# EasyEDA Pro project PID调试器（第一版）.eprj

# Schematic Schematic1
Board Name: Board1; Create Date: 2025-07-22; Page Name: P1; Project Name: PID调试器; Schematic Name: Schematic1; Update Date: 2025-08-16; Company: 嘉立创EDA; Page Size: A4; Version: V1.0
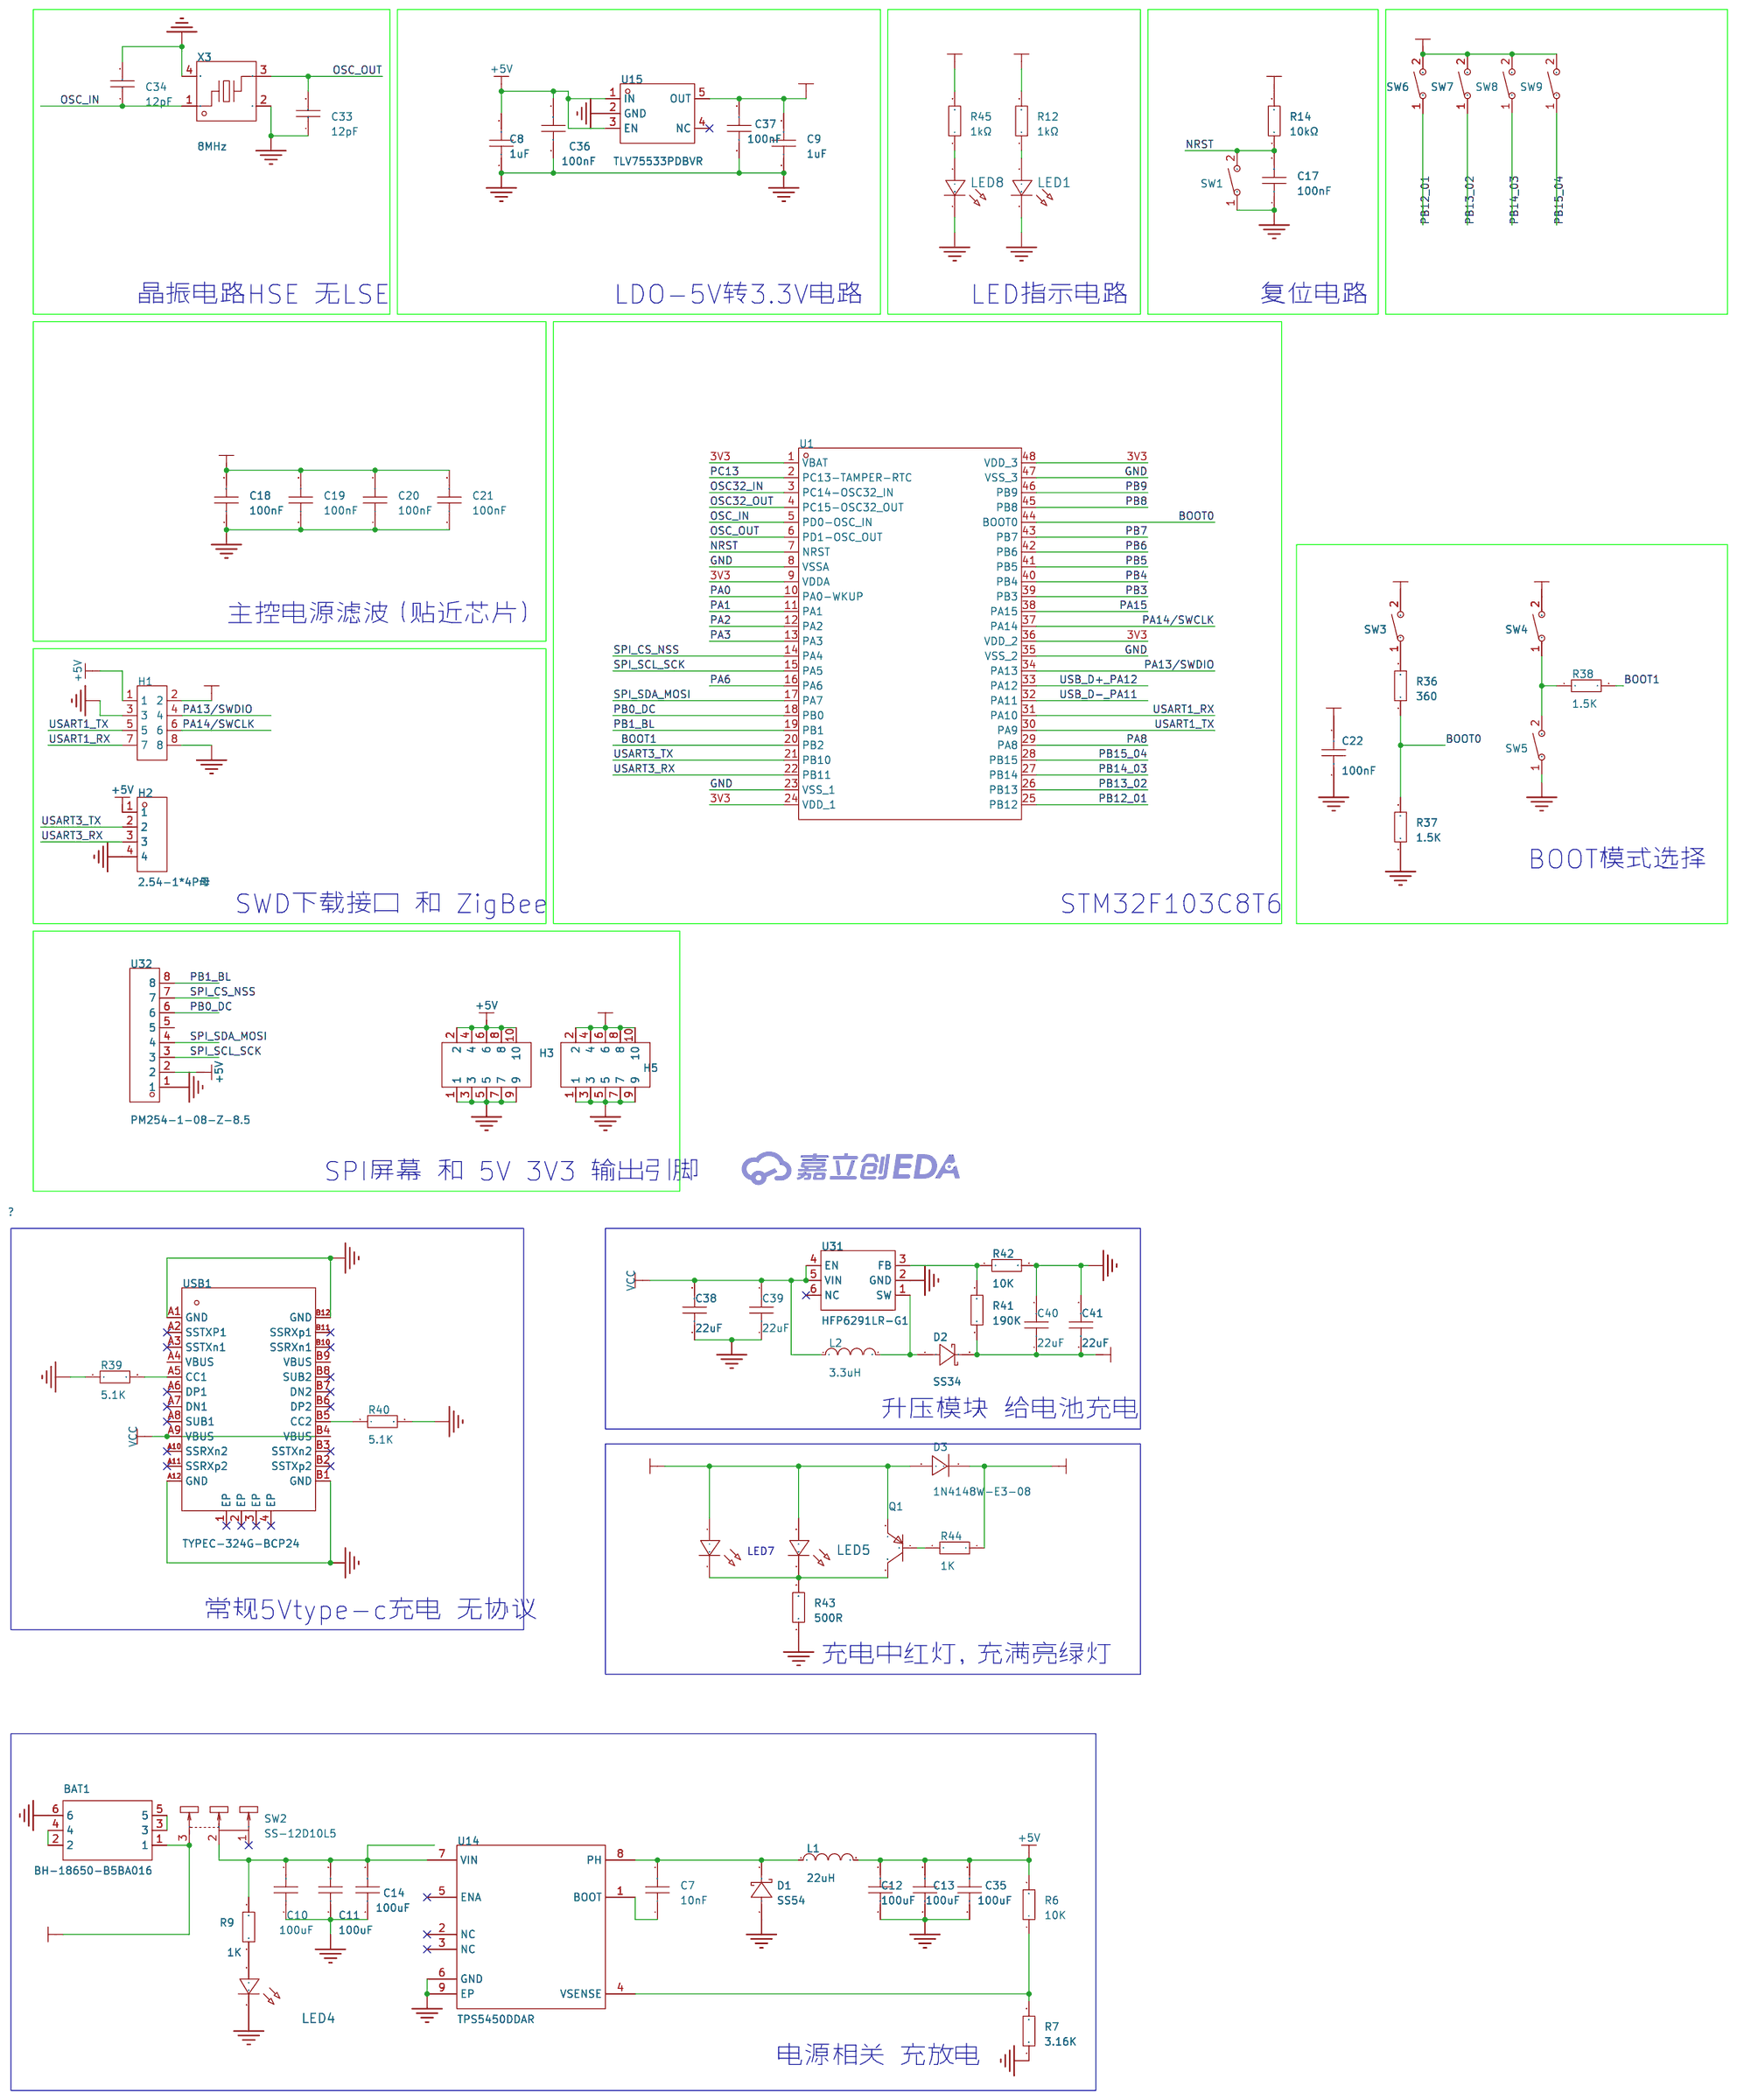
[diagram p0: schematic sheet]

## Parts
BAT1  BH-18650-B5BA016  [BAT-SMD_BH-18650-B5BA016]
C7  100nF  [C0603]
C8  100nF  [C0603]
C9  100nF  [C0603]
C10  100uF  [C1206]
C11  100uF  [C1206]
C12  100uF  [C1206]
C13  100uF  [C1206]
C14  100uF  [C1206]
C17  100nF  [R0603]
C18  100nF  [R0603]
C19  100nF  [R0603]
C20  100nF  [R0603]
C21  100nF  [R0603]
C22  100nF  [R0603]
C33  12pF  [R0603]
C34  12pF  [R0603]
C35  100uF  [C1206]
C36  100nF  [R0603]
C37  100nF  [R0603]
C38  22uF  [C0603]
C39  22uF  [C0603]
C40  22uF  [C0603]
C41  22uF  [C0603]
D1  SS54  [SMA_L4.3-W2.6-LS5.0-FD]
D2  SS34  [SMA_L4.3-W2.6-LS5.0-FD]
D3  1N4148W-E3-08  [SOD-123_L2.8-W1.8-LS3.7-RD]
H1  HX PZ2.54-4x2P ZZ  [HDR-TH_8P-P2.54-V-M-R2-C4-S2.54]
H2  2.54-1*4P母  [HDR-TH_4P-P2.54-V-F]
H3  PZ254V-12-10P  [HDR-TH_10P-P2.54-V-M-R2-C5-S2.54]
H5  PZ254V-12-10P  [HDR-TH_10P-P2.54-V-M-R2-C5-S2.54]
L1  22uH  [IND-SMD_L7.1-W6.6]
L2  3.3uH  [IND-SMD_L4.4-W4.2-A]
LED1  LTST-C190KSKT  [LED0603-RD]
LED4  -  [LED_0603]
LED5  -  [LED_0603]
LED7  -  [LED_0603]
LED8  LTST-C190KSKT  [LED0603-RD]
Q1  -  [S8550P_SOT]
R6  10K  [R0603]
R7  10K  [R0603]
R9  1K  [R0603]
R12  1kΩ  [R0603]
R14  10kΩ  [R0603]
R36  360  [R0603]
R37  1.5K  [R0603]
R38  1.5K  [R0603]
R39  5.1K  [R0603]
R40  5.1K  [R0603]
R41  190K  [R0603]
R42  10K  [R0603]
R43  500R  [R0603]
R44  1K  [R0603]
R45  1kΩ  [R0603]
SW1  TS-1101-B-W  [KEY-SMD_2P-L6.0-W3.6-P7.4-LS8.0-L]
SW2  SS-12D10L5  [SW-TH_SS-12D10L5]
SW3  TS-1101-B-W  [KEY-SMD_2P-L6.0-W3.6-P7.4-LS8.0-L]
SW4  TS-1101-B-W  [KEY-SMD_2P-L6.0-W3.6-P7.4-LS8.0-L]
SW5  TS-1101-B-W  [KEY-SMD_2P-L6.0-W3.6-P7.4-LS8.0-L]
SW6  TS-1101-B-W  [KEY-SMD_2P-L6.0-W3.6-P7.4-LS8.0-L]
SW7  TS-1101-B-W  [KEY-SMD_2P-L6.0-W3.6-P7.4-LS8.0-L]
SW8  TS-1101-B-W  [KEY-SMD_2P-L6.0-W3.6-P7.4-LS8.0-L]
SW9  TS-1101-B-W  [KEY-SMD_2P-L6.0-W3.6-P7.4-LS8.0-L]
U1  STM32F103C8T6  [LQFP-48_L7.0-W7.0-P0.50-LS9.0-BL]
U14  TPS5450DDAR  [SOP-8_L4.9-W3.9-P1.27-LS6.0-BL-EP]
U15  TLV75533PDBVR  [SOT-23-5_L3.0-W1.7-P0.95-LS2.8-BR]
U31  HFP6291LR-G1  [SOT-23-6_L2.9-W1.6-P0.95-LS2.8-BR]
U32  PM254-1-08-Z-8.5  [HDR-TH_8P-P2.54-V-F]
USB1  TYPEC-324G-BCP24  [USB-C-SMD_TYPEC-324G-BCP24]
X3  8MHz  [CRYSTAL-SMD_4P-L3.2-W2.5-BL-1]

## Library data of the parts
BAT1 = BH-18650-B5BA016: LCSC Part Name: 电池盒; Supplier Part: C19184086; Manufacturer: MYOUNG(美阳); Supplier Footprint: SMD; JLCPCB Part Class: 扩展库; Datasheet: https://atta.szlcsc.com/upload/public/pdf/source/20231108/D1617EC59CD55304B33DC60D90FEF183.pdf; Supplier: LCSC; Connector Type: 电池盒; Contact Plating: 金; Operating Temperature Range: -25℃~+85℃
C7-C9 C38-C41 = CAP_0603: Supplier Footprint: 0603
C10-C14 C35 = HGC1206R5107M100NSPJ: 容值:100uF;精度:±20%;额定电压:10V;材质(温度系数):X5R;; LCSC Part Name: 100uF ±20% 10V; Supplier Part: C7432784; Manufacturer: Chinocera(华瓷); Supplier Footprint: 1206; JLCPCB Part Class: 扩展库; Datasheet: https://atta.szlcsc.com/upload/public/pdf/source/20240320/FAC3FEC40A78BC5CCCE96C232A94D860.pdf; Supplier: LCSC; Tolerance: ±20%; Voltage Rated: 10V; Temperature Coefficient: X5R
C17-C22 C36 C37 = GRM155R71H104KE14D: 容值:100nF;精度:±10%;额定电压:50V;材质(温度系数):X7R;; LCSC Part Name: 100nF ±10% 50V; Supplier Part: C77020; Manufacturer: muRata(村田); Supplier Footprint: 0402; JLCPCB Part Class: 扩展库; Datasheet: https://atta.szlcsc.com/upload/public/pdf/source/20180326/C77020_39BD49C951FF1AF0DB1F1FAC5AC1E401.pdf; Supplier: LCSC; Tolerance: ±10%; Voltage Rated: 50V; Temperature Coefficient: X7R
C33 C34 = 0402CG120J500NT: 容值:12pF;精度:±5%;额定电压:50V;材质(温度系数):C0G;; LCSC Part Name: 12pF ±5% 50V; Supplier Part: C1547; Manufacturer: FH(风华); Supplier Footprint: 0402; JLCPCB Part Class: 基础库; Datasheet: https://atta.szlcsc.com/upload/public/pdf/source/20200305/C486355_26A10D38EF8C2A5C37091D0039909270.pdf; Supplier: LCSC; Tolerance: ±5%; Voltage Rated: 50V; Temperature Coefficient: C0G
D1 = SS54_C7420369: 二极管配置:独立式;正向压降(Vf):550mV@5.0A;直流反向耐压(Vr):40V;整流电流:5A;; LCSC Part Name: 电压:40V 电流:5A; Supplier Part: C7420369; Manufacturer: 宏迦橙; Supplier Footprint: SMA(DO-214AC); Datasheet: https://atta.szlcsc.com/upload/public/pdf/source/20230828/254C3882F8647358AD9F60DD73611B5E.pdf; Supplier: LCSC; Diode Configuration: 独立式; Forward Voltage (Vf@If): 550mV@5.0A; Reverse Voltage (Vr): 40V; Rectified Current: 5A; Reverse Leakage Current (Ir): 50uA@40V
D2 = SS34_C7420365: LCSC Part Name: 电压:40V 电流:3A; Supplier Part: C7420365; Manufacturer: 宏嘉诚; Supplier Footprint: SMA(DO-214AC); JLCPCB Part Class: 扩展库; Datasheet: https://item.szlcsc.com/datasheet/SS34/8397187.html; Supplier: LCSC; Diode Configuration: 独立式; Voltage - Forward(Vf@If): 550mV@3.0A; Voltage - DC Reverse(Vr): 40V; Current - Rectified: 3A; Reverse Leakage Current (Ir): 200uA@40V
D3 = 1N4148W-E3-08: Supplier Part: C241939; Manufacturer: VISHAY(威世); Supplier Footprint: SOD-123; Datasheet: https://item.szlcsc.com/datasheet/1N4148W-E3-08/240783.html; Supplier: LCSC; Diode Configuration: 1个独立式; Voltage - Forward(Vf@If): 1.2V@100mA; Voltage - DC Reverse(Vr): 75V; Current - Rectified: 150mA; Pd - Power Dissipation: 350mW; Reverse Leakage Current (Ir): 100uA@100V; Reverse Recovery Time (trr): 4ns; Non-Repetitive Peak Forward Surge Current: 2A
H1 = HX PZ2.54-4x2P ZZ: LCSC Part Name: 4x2P 间距:2.54mm 方针 直插; Supplier Part: C32713296; Manufacturer: hanxia(韩下); Supplier Footprint: 插件,P=2.54mm; JLCPCB Part Class: 扩展库; Datasheet: https://atta.szlcsc.com/upload/public/pdf/source/20240723/0F23DD8D77880DC95952980E48B1CF7C.pdf; Supplier: LCSC; Pin Structure: 4x2P; Pitch: 2.54mm; Row Spacing: 2.54mm; Circluar Pins/Square Pins: 方针; Mounting Type: 直插; Number of Rows: 四排; Number of Pins: 8P; Current Rating: 3A; Length of Mating Pin: 6mm; Insulation Height: 2.5mm; Length of End Connection Pin: 3mm; Contact Material: 黄铜; Contact Plating: 金; Operating Temperature: -40℃~+105℃; Color: 黑色
H2 = 2.54-1*4P母: LCSC Part Name: 间距:2.54mm 1x4P 直插; Supplier Part: C2718488; Manufacturer: BOOMELE(博穆精密); Supplier Footprint: 插件,P=2.54mm; JLCPCB Part Class: 扩展库; Datasheet: https://atta.szlcsc.com/upload/public/pdf/source/20210301/C2718488_F4427B881E42CAA8DDB0B1C12B3A522C.pdf; Supplier: LCSC; Holes Structure: 1x4P; Pitch: 2.54mm; Circular Hole / Square Hole: 方孔; Mounting Type: 直插; Number of Rows: 单排; Number of Holes: 4P; Current Rating (Max): 3A; Holes Direction: 顶部; Contact Material: 青铜; Operating Temperature Range: -40℃~+105℃
H3 H5 = PZ254V-12-10P: LCSC Part Name: 2x5P 间距:2.54mm 方针 直插; Supplier Part: C492422; Manufacturer: XFCN(兴飞); Supplier Footprint: 插件,P=2.54mm; JLCPCB Part Class: 扩展库; Datasheet: https://atta.szlcsc.com/upload/public/pdf/source/20200309/C492422_5020CEA01BE7051F9EA9DD81AB0A25E3.pdf; Supplier: LCSC; Pin Structure: 2x5P; Pitch: 2.54mm; Row Spacing: 2.54mm; Circluar Pins/Square Pins: 方针; Mounting Type: 直插; Number of Rows: 双排; Number of Pins: 10P; Length of Mating Pin: 6mm; Insulation Height: 2.5mm; Length of End Connection Pin: 3mm; Contact Material: 黄铜; Operating Temperature: -40℃~+105℃; Color: 黑色
L1 = YSPI0630A-220M: 电感值:22uH;精度:±20%;额定电流:3A;; LCSC Part Name: 22uH ±20%; Supplier Part: C497873; Manufacturer: YJYCOIN(益嘉源); Supplier Footprint: SMD,6.6x7.1mm; JLCPCB Part Class: 扩展库; Datasheet: https://atta.szlcsc.com/upload/public/pdf/source/20200317/C497869_D09F597887D5FB8B541C5C98B400E286.pdf; Supplier: LCSC; Tolerance: ±20%; Rated Current: 3A; DC Resistance (DCR): 130mΩ
L2 = FXL0420-3R3-M: LCSC Part Name: 3.3uH ±20% 4A; Supplier Part: C167207; Manufacturer: cjiang(长江微电); Supplier Footprint: SMD,4.2x4.4mm; JLCPCB Part Class: 扩展库; Datasheet: https://atta.szlcsc.com/upload/public/pdf/source/20240426/3189EA8206330E2108542F9E34E540E7.pdf; Supplier: LCSC; Tolerance: ±20%; Rated Current: 3.3A; Saturation Current (Isat): 4A; DC Resistance (DCR): 87mΩ; Type: 一体成型电感
LED1 LED8 = LTST-C190KSKT: LCSC Part Name: 黄灯; Supplier Part: C125095; Manufacturer: LITEON(光宝); Supplier Footprint: 0603; JLCPCB Part Class: Extended Part; Datasheet: https://atta.szlcsc.com/upload/public/pdf/source/20180129/C125095_15171881843821315881.pdf; Supplier: LCSC; Emitted Color: 黄色; Forward Voltage (VF): 2.1V; Power Dissipation: 75mW; Forward Current: 20mA; Dominant Wavelength: 584.5nm~597nm; Peak Wavelength: 588nm; Lens Color: 无色透明透镜; Luminous Intensity: 104mcd; Viewing Angle: 130°; Operating Temperature: -30℃~+85℃
LED4 LED5 = LED_0603-R: Supplier Footprint: 0603
LED7 = LED_0603-G: Supplier Footprint: 0603
Q1 = S8550_SOT_PNP: Supplier Footprint: SOT-23
R6 R7 R9 R36-R44 = Res_0603: Supplier Footprint: 0603
R12 R45 = 0402WGF1001TCE: 电阻类型:厚膜电阻;阻值:1kΩ;精度:±1%;功率:62.5mW;最大工作电压:50V;温度系数:±100ppm/℃;; LCSC Part Name: 1kΩ ±1% 62.5mW 厚膜电阻; Supplier Part: C11702; Manufacturer: UNI-ROYAL(厚声); Supplier Footprint: 0402; JLCPCB Part Class: 基础库; Datasheet: https://atta.szlcsc.com/upload/public/pdf/source/20200306/C422600_1E6D84923E4A46A82E41ADD87F860B5C.pdf; Supplier: LCSC; Type: 厚膜电阻; Tolerance: ±1%; Power(Watts): 62.5mW; Overload Voltage (Max): 50V; Temperature Coefficient: ±100ppm/℃; Operating Temperature Range: -55℃~+155℃
R14 = RC0402FR-0710KL: 电阻类型:厚膜电阻;阻值:10kΩ;精度:±1%;功率:62.5mW;最大工作电压:50V;温度系数:±100ppm/℃;; LCSC Part Name: 厚膜电阻 10kΩ ±1% 62.5mW; Supplier Part: C60490; Manufacturer: YAGEO(国巨); Supplier Footprint: 0402; JLCPCB Part Class: 扩展库; Datasheet: https://atta.szlcsc.com/upload/public/pdf/source/20170925/C131467_1506321478108990263.pdf; Supplier: LCSC; Type: 厚膜电阻; Tolerance: ±1%; Power(Watts): 62.5mW; Overload Voltage (Max): 50V; Temperature Coefficient: ±100ppm/℃; Operating Temperature Range: -55℃~+155℃
SW1 SW3-SW9 = TS-1101-B-W_C500065: 触点电流:50mA;额定电压(DC):12V;绝缘电阻:-;电路结构:单刀单掷;安装方式:立贴;带灯:无;作用力:160gf;机械寿命:5万次;带支架:否;; LCSC Part Name: 6*3.6*2.5mm 立贴 轻触开关; Supplier Part: C500065; Manufacturer: XKB Connectivity(中国星坤); Supplier Footprint: SMD; JLCPCB Part Class: 扩展库; Datasheet: https://atta.szlcsc.com/upload/public/pdf/source/20211011/D0E0CAF534F7B19DDE4CE68748A25BD3.pdf; Supplier: LCSC; Contact Current: 50mA; Voltage Rating (DC): 12V; Circuit: 单刀单掷; Mounting Style: 立贴; Actuator Style: 矩形按钮; Actuator/Cap Color: 白色; With Lamp: 无; Operating Force: 160gf; Mechanical Life: 5万次; Operating Temperature: -30℃~+85℃; Switch Length: 6mm; Switch Width: 3.6mm; Switch Height: 2.5mm; Strike Gundam: 否
SW2 = SS-12D10L5: 电路结构:单刀双掷;安装方式:直插;开关颜色:黑色;额定电流(DC):3A;额定电压(DC):125V;额定电流(AC):3A;额定电压(AC):125V;机械寿命:1万次;; LCSC Part Name: 柄长5mm 直插双档 滑动开关; Supplier Part: C319012; Manufacturer: XKB Connectivity(中国星坤); Supplier Footprint: 插件; Datasheet: https://atta.szlcsc.com/upload/public/pdf/source/20211009/D6412F37AABE6F9459A6EE7FA4DAEADB.pdf; Supplier: LCSC; Circuit: 单刀双掷; Actuator Style: 矩形柱状; Pin Style: PC引脚; Switch Length: 13mm; Switch Width: 6.8mm; Switch Height: 6.4mm; Mounting Style: 直插; Actuator Color: 黑色; Current Rating (DC): 3A; Voltage Rating (DC): 125V; Current Rating (AC): 3A; Voltage Rating (AC): 125V; Mechanical Life: 1万次; Operating Temperature: -40℃~+85℃
U1 = STM32F103C8T6: CPU内核:CM3;程序存储容量:64KB;RAM总容量:20KB;GPIO端口数量:37;工作电压范围:2V~3.6V;CPU最大主频:72MHz;程序存储器类型:FLASH;; LCSC Part Name: STM32F103C8T6 MSL=3; Supplier Part: C8734; Manufacturer: ST(意法半导体); Supplier Footprint: LQFP-48(7x7); JLCPCB Part Class: 扩展库; Datasheet: https://atta.szlcsc.com/upload/public/pdf/source/20220812/8363ACEC51AD55ECEB84799464F7CB85.pdf; Supplier: LCSC; CPU Core: CM3; Program Storage Size: 64KB; RAM Size: 20KB; GPIO Ports Number: 37; Operating Voltage Range: 2V~3.6V; CPU Maximum Speed: 72MHz; Program Memory Type: FLASH; Operating Temperature Range: -40℃~+85℃; ADC (Bit): 12bit; Universal Serial Bus: 有; Peripheral/Function: 看门狗；DMA；看门狗；片载温度传感器; Watchdog: 有; Infrared Data Association: 有; Low-Voltage Detect: 有; Direct Memory Access: 有; Internal Oscillator: 有
U14 = TPS5450DDAR: 功能类型:降压型;输出类型:可调;工作电压:5.5V~36V;输出电压:1.221V~31.32V;输出电流:5A;; LCSC Part Name: 5A宽输入范围降压转换器; Supplier Part: C114425; Manufacturer: TI(德州仪器); Supplier Footprint: SOP-8-EP-150mil; JLCPCB Part Class: 扩展库; Datasheet: https://www.ti.com/cn/lit/gpn/tps5450; Supplier: LCSC; Function: 降压型; Output Type: 可调; Input Voltage: 5.5V~36V; Output Voltage: 1.221V~31.32V; Output Current: 5A; Switching Frequency: 500kHz; Operating Temperature: -40℃~+125℃@(TJ); Synchronous Rectification: 否; Number of Outputs: 1; Topology: 降压式; Switch tube (built-in/external): 内置
U15 = TLV75533PDBVR: 输出类型:固定;最大输入电压:5.5V;输出电压:3.3V;输出电流:500mA;电源纹波抑制比(PSRR):52dB;输出极性:正极;; LCSC Part Name: 具有使能功能的 500mA、高 PSRR、低 IQ、低压降稳压器; Supplier Part: C404027; Manufacturer: TI(德州仪器); Supplier Footprint: SOT-23-5; JLCPCB Part Class: 扩展库; Datasheet: https://www.ti.com/cn/lit/gpn/tlv755p; Supplier: LCSC; Output Type: 固定; Maximum Input Voltage: 5.5V; Output Voltage: 3.3V; Output Current: 500mA; Power Supply Rejection Ratio (PSRR): 52dB; Dropout Voltage: 238mV@(500mA); standby current: 31uA; Feature: 防静电保护；浪涌保护；低ESR；热保护(TSD)；欠压闭锁；过流保护(OCP)；带使能; Operating Temperature: -40℃~+125℃@(Tj); Output Polarity: 正极; Number of Outputs: 1
U31 = HFP6291LR-G1: LCSC Part Name: 微小型高效率升压型DC/DC调整器; Supplier Part: C22396393; Manufacturer: HXY MOSFET(华轩阳电子); Supplier Footprint: SOT-23-6L; JLCPCB Part Class: 扩展库; Datasheet: https://atta.szlcsc.com/upload/public/pdf/source/20240509/A9FF322FD4EEEBF153044EDD76C1B9E3.pdf; Supplier: LCSC; Function: 升压型; Voltage - Supply: 2V~24V; Frequency - Switching: 1.2MHz; Operating Temperature: -40℃~+80℃; Number of Outputs: 1; Topology: 升压式; Switch tube (built-in/external): 内置
U32 = PM254-1-08-Z-8.5: LCSC Part Name: 1x8P 间距:2.54mm 直插; Supplier Part: C2897371; Manufacturer: HCTL(华灿天禄); Supplier Footprint: 插件,P=2.54mm; JLCPCB Part Class: 扩展库; Datasheet: https://atta.szlcsc.com/upload/public/pdf/source/20230609/534BE42964C679BDE98E061007C4ABD6.pdf; Supplier: LCSC; Holes Structure: 1x8P; Pitch: 2.54mm; Circular Hole / Square Hole: 方孔; Mounting Type: 直插; Number of Rows: 单排; Number of Holes: 8P; Current Rating (Max): 3A; Holes Direction: 顶部; Insulation Height: 8.5mm; Contact Material: 铜合金; Operating Temperature Range: -40℃~+105℃; Soldering Temperature(Max): 260℃@5S
USB1 = TYPEC-324G-BCP24: LCSC Part Name: Type-C 母 卧贴; Supplier Part: C920230; Manufacturer: XUNPU(讯普); Supplier Footprint: SMD; JLCPCB Part Class: 扩展库; Datasheet: https://atta.szlcsc.com/upload/public/pdf/source/20240730/570E6E6917F128F926C9CCEF1574B0B5.pdf; Supplier: LCSC; Connector Type: Type-C; Standard: USB 3.1; Gender: 母; Mounting Style: 卧贴; Number of Contacts: 24P; Number of Ports: 1; Current Rating - Power (Max): 5A; Operating Temperature Range: -45℃~+85℃
X3 = XL2EL89COI-111YLC-8M: 晶振类型:贴片晶振;频率:8MHz;常温频差:±10ppm;外接负载电容:12pF;频率稳定度(全温):±20ppm;; LCSC Part Name: 8MHz ±10ppm 12pF; Supplier Part: C2973805; Manufacturer: YXC(扬兴晶振); Supplier Footprint: SMD3225-4P; JLCPCB Part Class: 扩展库; Datasheet: https://atta.szlcsc.com/upload/public/pdf/source/20240329/19D5F850207469550BEB00D7DFEDBC7A.pdf; Supplier: LCSC; Crystal Type: 贴片晶振; Normal temperature Frequency Tolerance: ±10ppm; External load capacitor: 12pF; Frequency Stability(Full temperature range): ±20ppm; Equivalent Series Resistance (ESR): 150Ω; Operating Temperature: -40℃~+85℃

## Nets
3V3: C9.2 C18.2 C19.2 C20.2 C21.2 C22.2 C37.2 H1.2 H5.2 H5.4 H5.6 H5.8 H5.10 R12.2 R14.2 SW3.2 SW4.2 SW6.2 SW7.2 SW8.2 SW9.2 U1.1(VBAT) U1.9(VDDA) U1.24(VDD_1) U1.36(VDD_2) U1.48(VDD_3) U15.5(OUT)
+5V: C8.2 C12.2 C13.2 C35.2 C36.2 H1.1 H2.1 H3.2 H3.4 H3.6 H3.8 H3.10 L1.2 R6.2 R45.2 U15.1(IN) U15.3(EN) U32.2
+12V: C40.1 C41.1 D2.2(K) D3.2(A) LED5.2(A) LED7.2(A) Q1.2(E) R41.1
GND: BAT1.6 C8.1 C9.1 C10.1 C11.1 C12.1 C13.1 C14.1 C17.1 C18.1 C19.1 C20.1 C21.1 C22.1 C33.1 C34.2 C35.1 C36.1 C37.1 C38.1 C39.1 C40.2 C41.2 D1.1(A) H1.3 H1.8 H2.4 H3.1 H3.3 H3.5 H3.7 H3.9 H5.1 H5.3 H5.5 H5.7 H5.9 LED1.1(C) LED4.1(C) LED8.1(C) R7.1 R37.1 R39.1 R40.2 R42.2 R43.1 SW1.1 SW5.1 U1.8(VSSA) U1.23(VSS_1) U1.35(VSS_2) U1.47(VSS_3) U14.6(GND) U14.9(EP) U15.2(GND) U31.2(GND) U32.1 USB1.A1(GND) USB1.A12(GND) USB1.B1(GND) USB1.B12(GND) X3.2(GND) X3.4(GND)
VCC: C38.2 C39.2 L2.1 U31.4(EN) U31.5(VIN) USB1.A9(VBUS) USB1.B4(VBUS)
VIN: BAT1.1 D3.1(K) R44.1 SW2.3
BOOT0: R36.1 R37.2 U1.44(BOOT0)
BOOT1: R38.2 U1.20(PB2)
NRST: C17.2 R14.1 SW1.2 U1.7(NRST)
OSC32_IN: U1.3(PC14-OSC32_IN)
OSC32_OUT: U1.4(PC15-OSC32_OUT)
OSC_IN: C34.1 U1.5(PD0-OSC_IN) X3.1
OSC_OUT: C33.2 U1.6(PD1-OSC_OUT) X3.3
PA0: U1.10(PA0-WKUP)
PA1: U1.11(PA1)
PA2: U1.12(PA2)
PA3: U1.13(PA3)
PA6: U1.16(PA6)
PA8: U1.29(PA8)
PA13/SWDIO: H1.4 U1.34(PA13)
PA14/SWCLK: H1.6 U1.37(PA14)
PA15: U1.38(PA15)
PB0_DC: U1.18(PB0) U32.6
PB1_BL: U1.19(PB1) U32.8
PB3: U1.39(PB3)
PB4: U1.40(PB4)
PB5: U1.41(PB5)
PB6: U1.42(PB6)
PB7: U1.43(PB7)
PB8: U1.45(PB8)
PB9: U1.46(PB9)
PB12_01: SW6.1 U1.25(PB12)
PB13_02: SW7.1 U1.26(PB13)
PB14_03: SW8.1 U1.27(PB14)
PB15_04: SW9.1 U1.28(PB15)
PC13: U1.2(PC13-TAMPER-RTC)
SPI_CS_NSS: U1.14(PA4) U32.7
SPI_SCL_SCK: U1.15(PA5) U32.3
SPI_SDA_MOSI: U1.17(PA7) U32.4
USART1_RX: H1.7 U1.31(PA10)
USART1_TX: H1.5 U1.30(PA9)
USART3_RX: H2.3 U1.22(PB11)
USART3_TX: H2.2 U1.21(PB10)
USB_D+_PA12: U1.33(PA12)
USB_D-_PA11: U1.32(PA11)
$1N1992: LED1.2(A) R12.1
$1N3257: R38.1 SW4.1 SW5.2
$1N4251: C10.2 C11.2 C14.2 R9.2 SW2.2 U14.7(VIN)
$1N4254: C7.2 D1.2(K) L1.1 U14.8(PH)
$1N4256: C7.1 U14.1(BOOT)
$1N4260: R6.1 R7.2 U14.4(VSENSE)
$1N4269: LED4.2(A) R9.1
$1N6190: BAT1.2 BAT1.4
$1N6207: BAT1.3 BAT1.5
$1N14427: R39.2 USB1.A5(CC1)
$1N14460: R40.1 USB1.B5(CC2)
$1N14741: D2.1(A) L2.2 U31.1(SW)
$1N14892: R41.2 R42.1 U31.3(FB)
$1N19318: LED5.1(C) LED7.1(C) Q1.3(C) R43.2
$1N19371: Q1.1(B) R44.2
$1N21612: R36.2 SW3.1
$1N31426: LED8.2(A) R45.1

Not connected (* = marked no-connect by the designer): SW2 1*; U14 2(NC)* 3(NC)* 5(ENA)*; U15 4(NC)*; U31 6(NC)*; U32 5; USB1 1(EP)* 2(EP)* 3(EP)* 4(EP)* A2(SSTXP1)* A3(SSTXn1)* A4(VBUS) A6(DP1)* A7(DN1)* A8(SUB1)* A10(SSRXn2)* A11(SSRXp2)* B2(SSTXp2)* B3(SSTXn2)* B6(DP2)* B7(DN2)* B8(SUB2)* B9(VBUS) B10(SSRXn1)* B11(SSRXp1)*

## Notes on the sheet
- 晶振电路HSE 无LSE
- LDO-5V转3.3V电路
- LED指示电路
- 复位电路
- 主控电源滤波（贴近芯片）
- BOOT模式选择
- SWD下载接口 和 ZigBee
- STM32F103C8T6
- SPI屏幕 和 5V 3V3 输出引脚
- 升压模块 给电池充电
- 常规5Vtype-c充电 无协议
- 充电中红灯，充满亮绿灯
- 电源相关 充放电

# Board PCB1
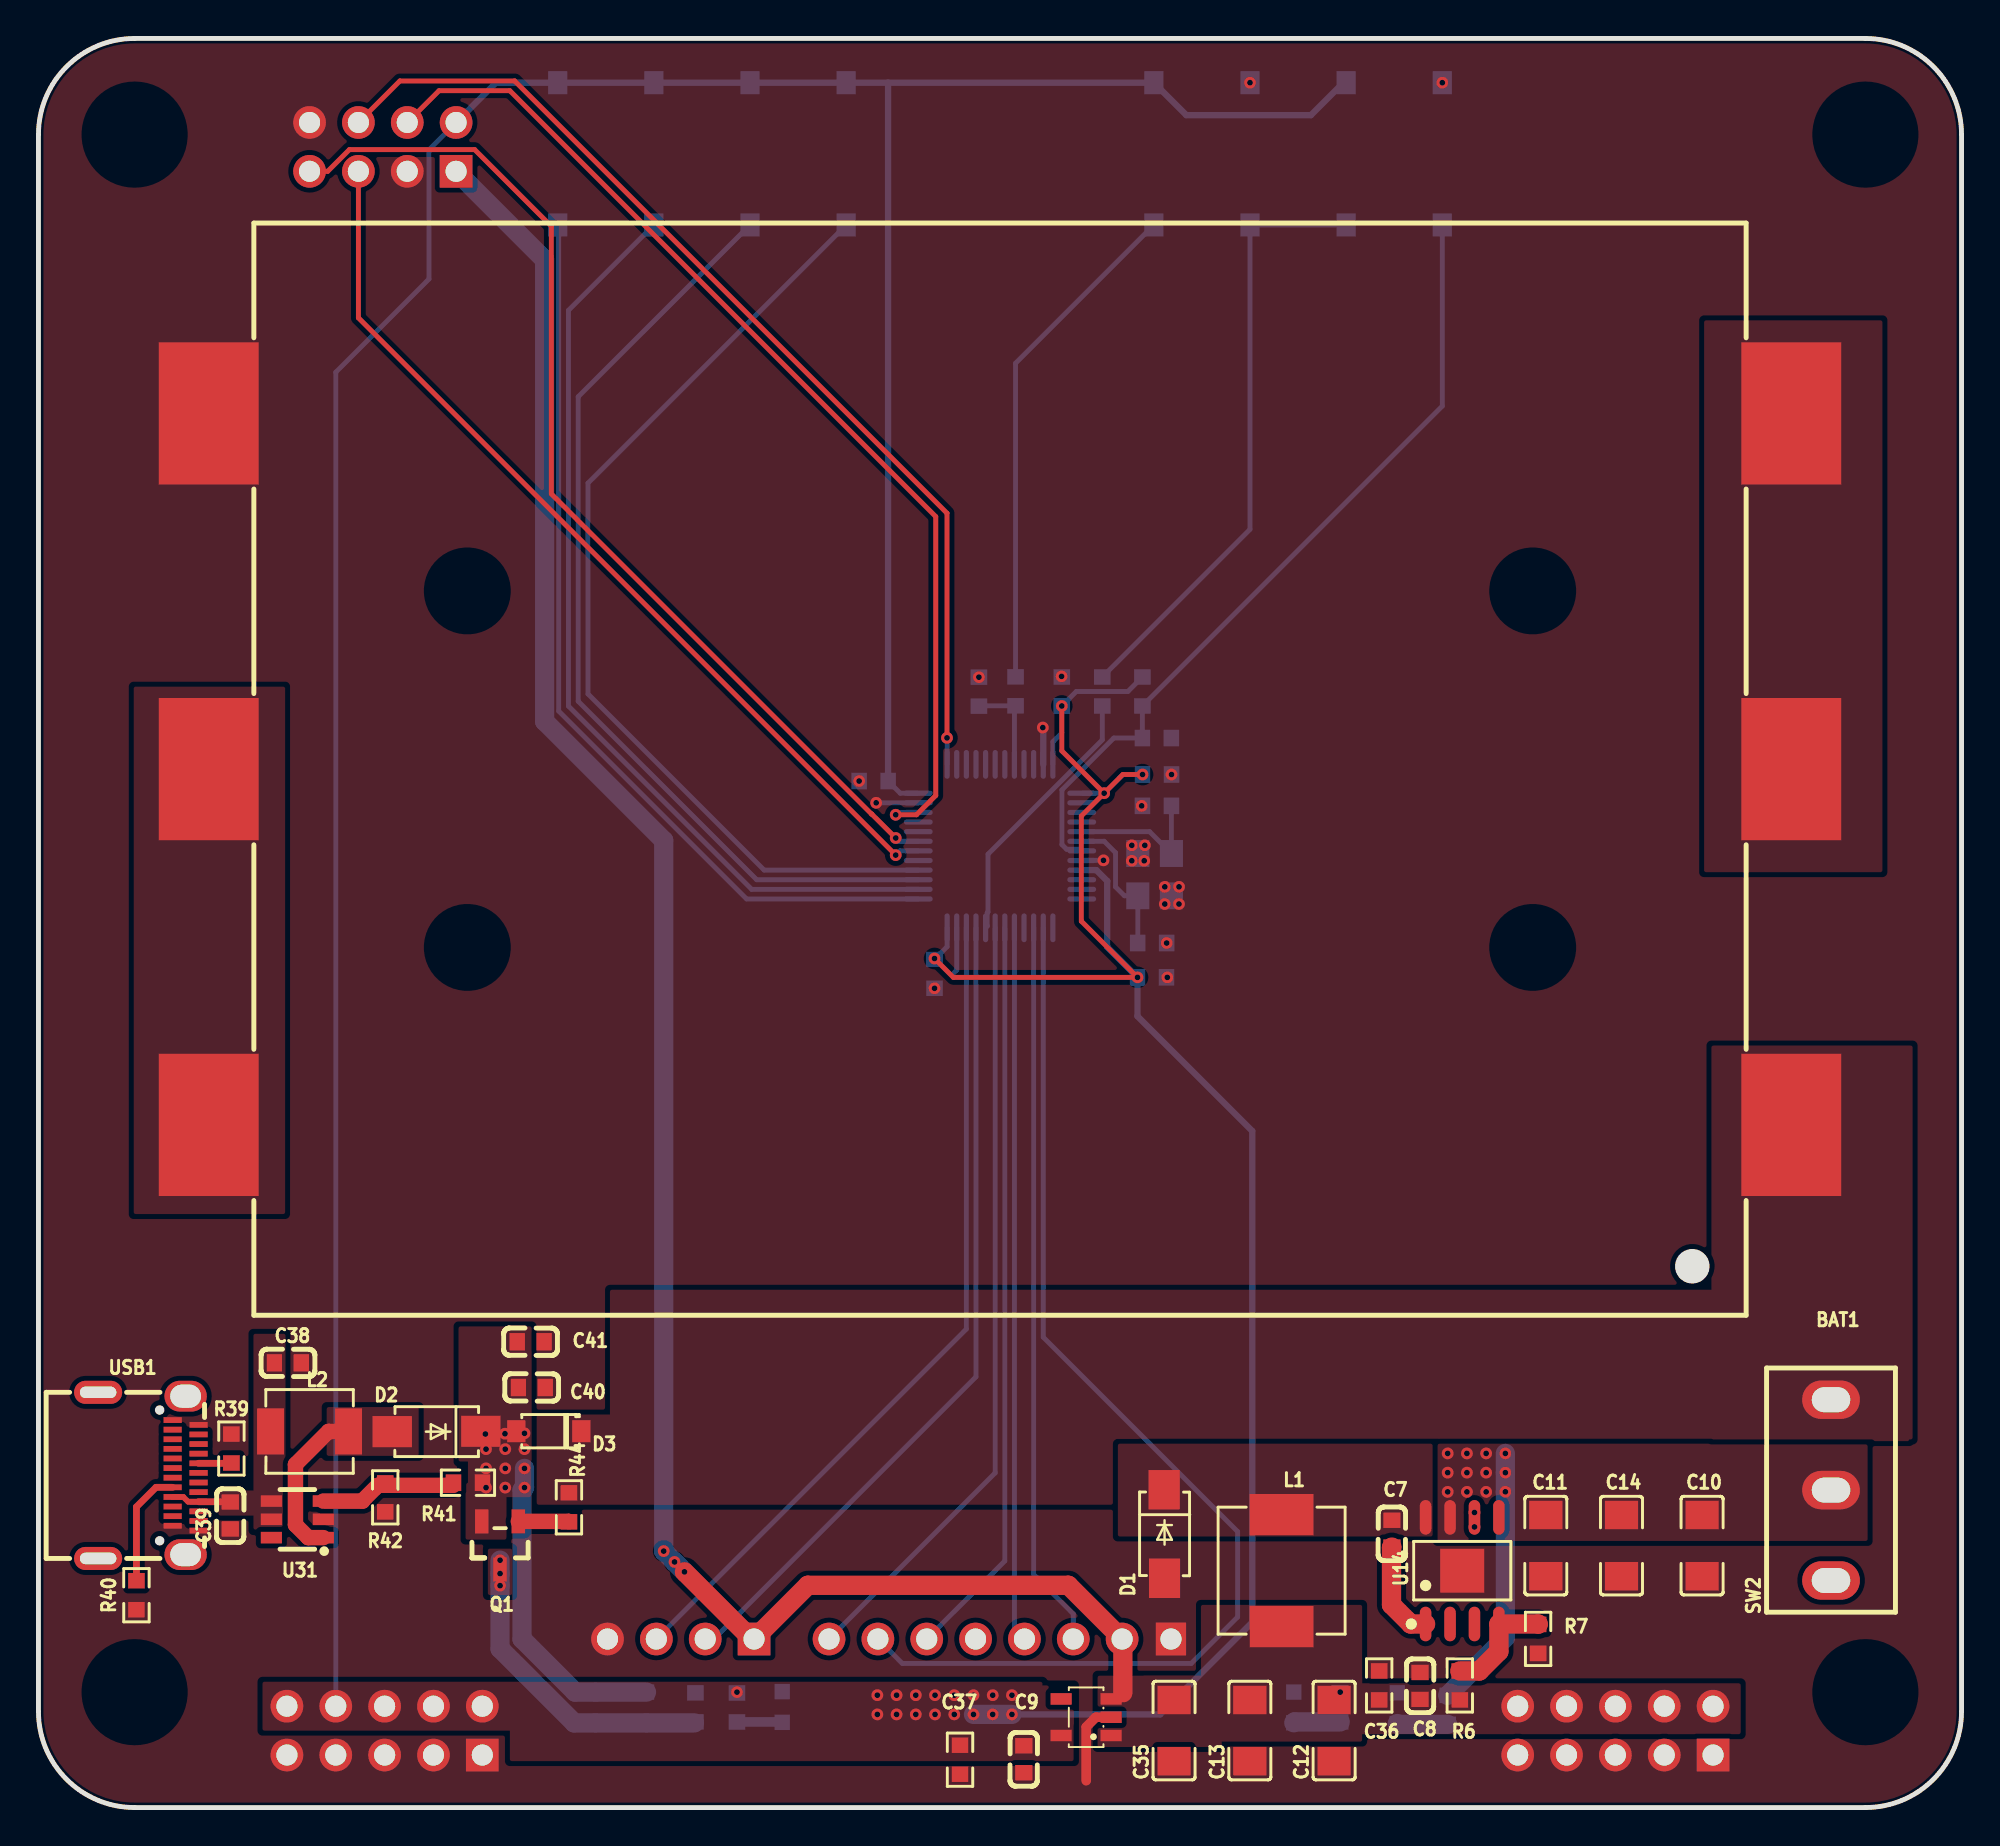
[diagram p1: board, top side]
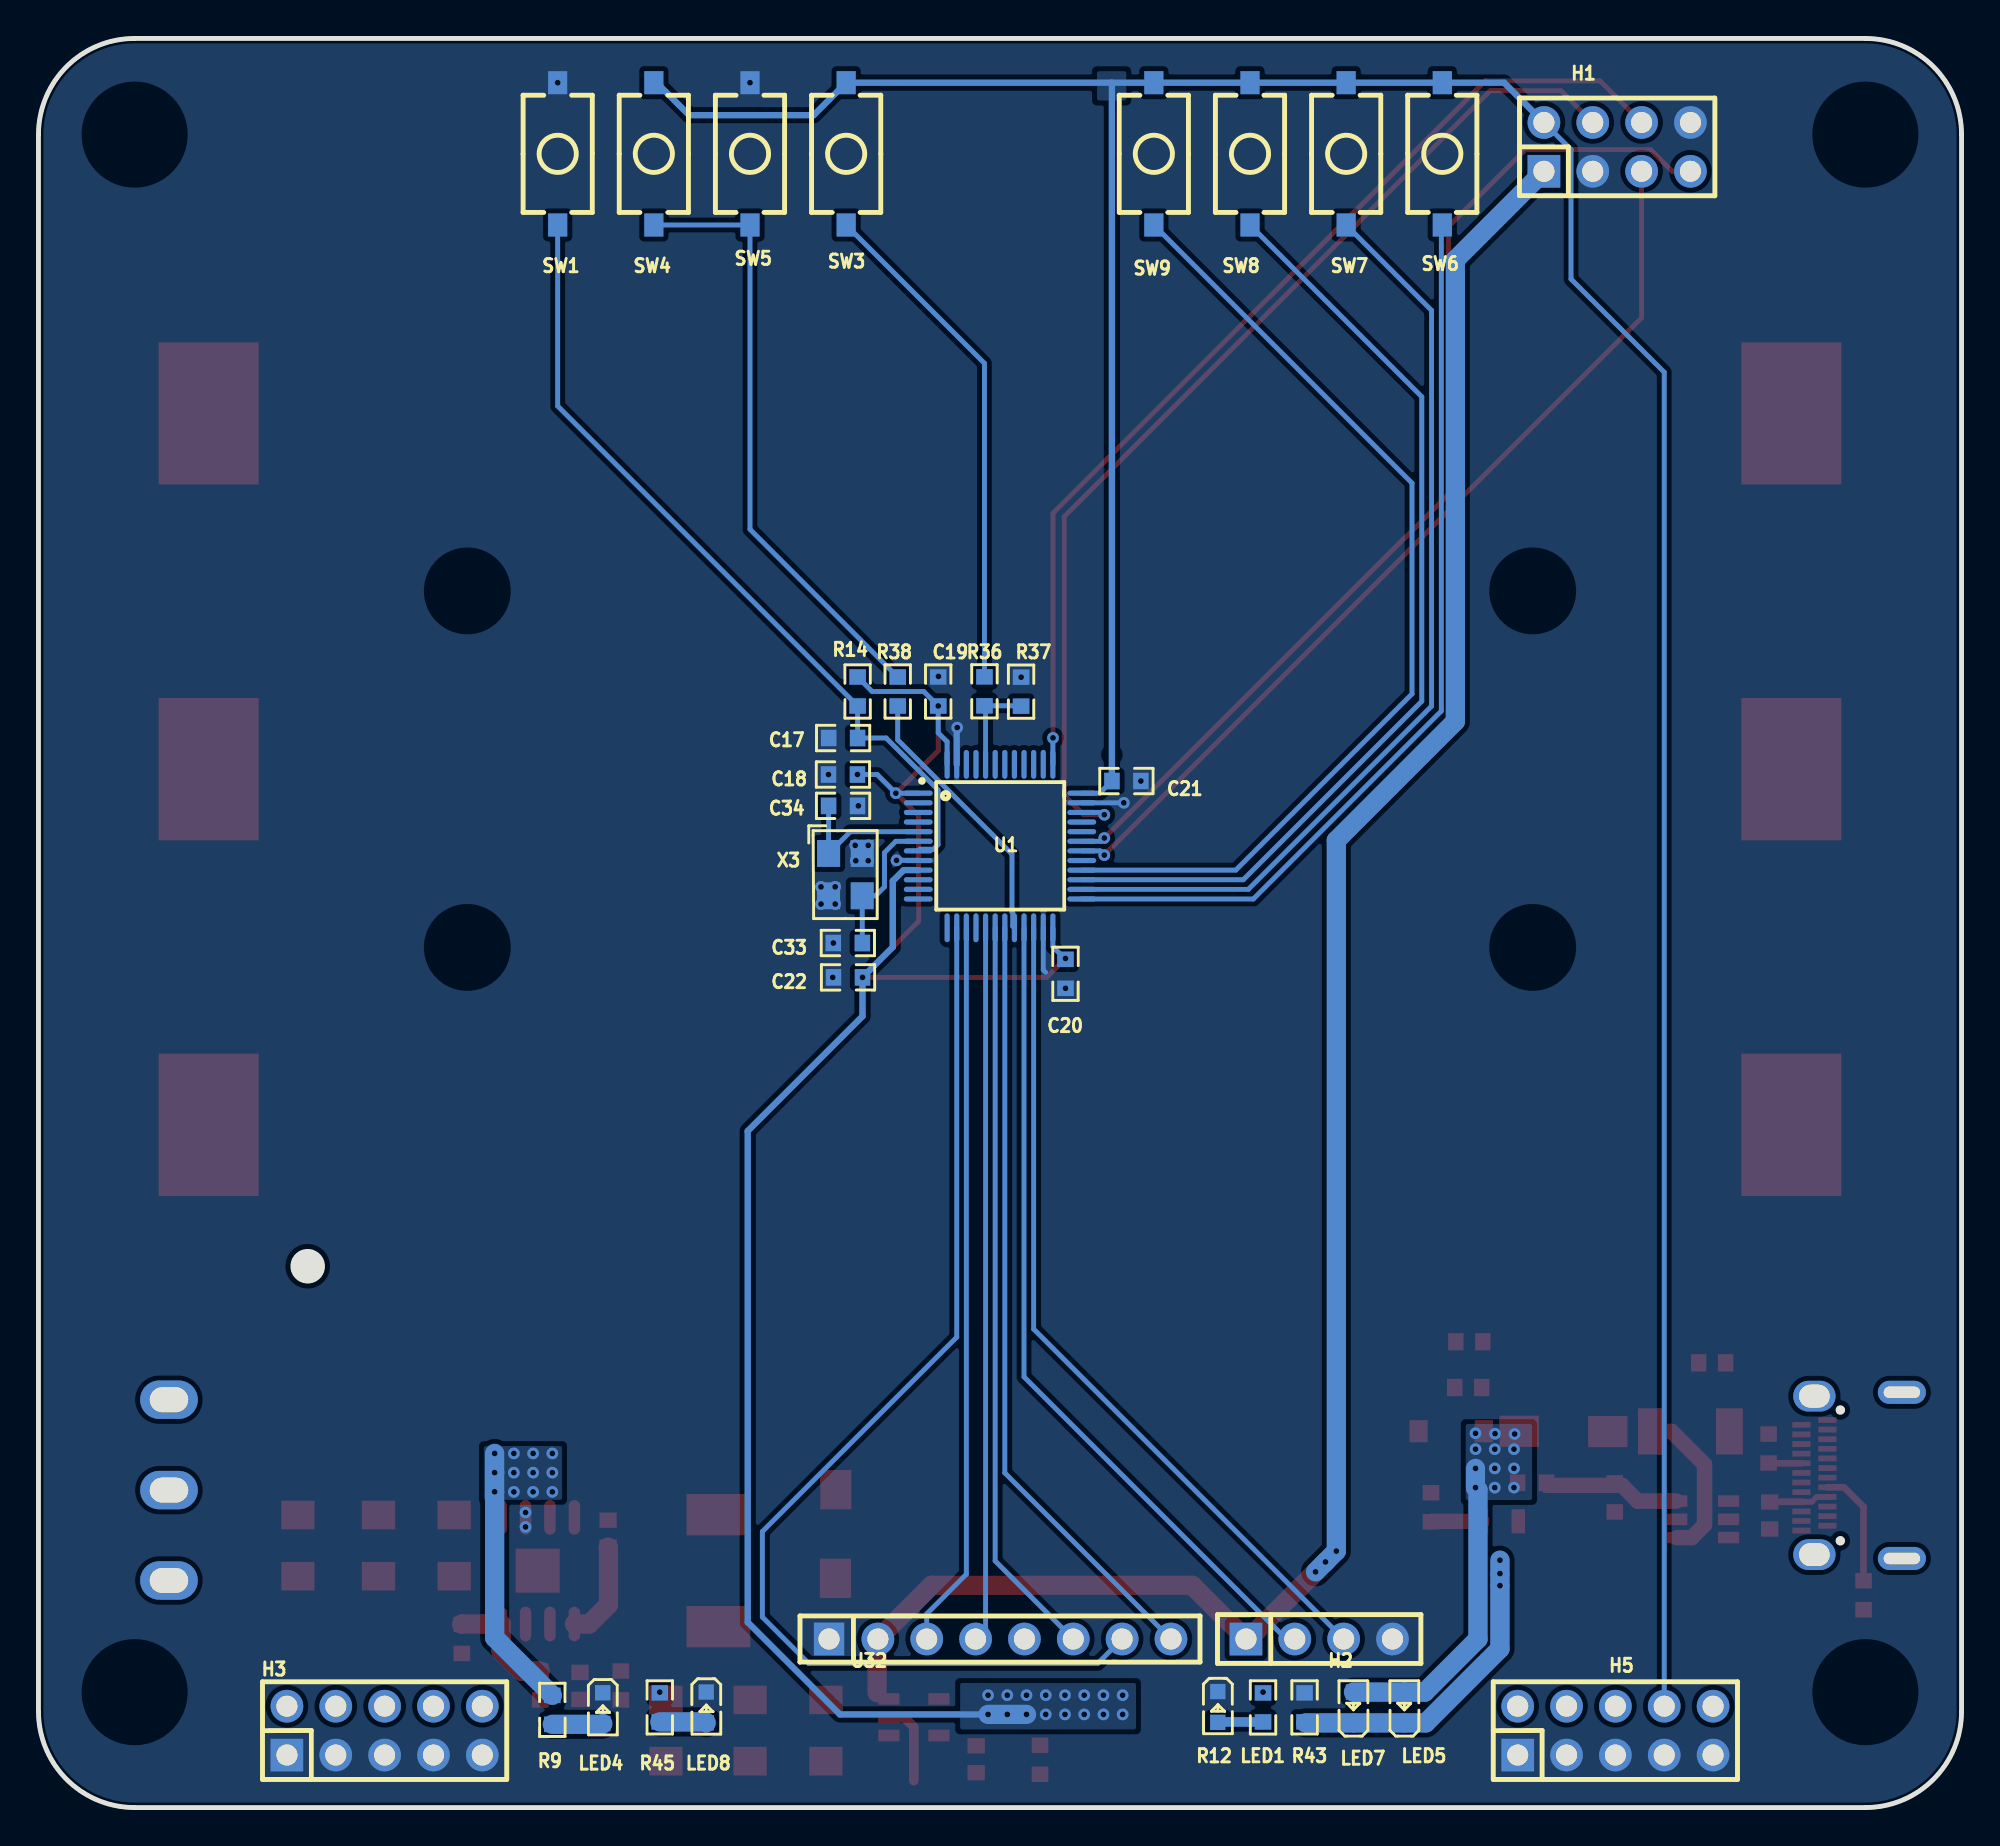
[diagram p2: board, bottom side, seen from below]

Outline 100 x 92 mm; copper layers: Top Layer, Bottom Layer. Coordinates in mm from the lower left corner of the outline.
Outline path: 0,87 0,5 arc(1.46,1.46) 5,0 95,0 arc(98.54,1.46) 100,5 100,87 arc(98.54,90.54) 95,92 5,92 arc(1.46,90.54) 0,87
Stack: Top Layer 0.035mm / Dielectric1 1.51mm FR4 er 4.5 / Bottom Layer 0.035mm

## Design rules (mm)
net OSC_OUT: DP1
net OSC_IN: DP1
template: 自定义配置
spacing copperThickness1oz (default): track to track 0.102, other pairs 0.152 to 0.3
spacing copperThickness2oz: track to track 0.203, other pairs 0.152 to 0.3
track width copperThickness1oz (default): min 0.127, default 0.254, max 2.54
track width copperThickness2oz: min 0.203, default 0.254, max 2.54
differential pair differentialPair (default): width min 0.127, default 0.254, max 2.54; gap min 0.152, default 0.152
via viaSize (default): diameter min 0.5, default 0.61, max 10; hole min 0.3, default 0.305, max 6.3

## Placement (name value [footprint] x y rotation side)
BAT1  BH-18650-B5BA016  [BAT-SMD_BH-18650-B5BA016]  50 54 180 top
C7  100nF  [C0603]  70.38 14.24 90 top
C8  100nF  [C0603]  71.84 6.33 270 top
C9  100nF  [C0603]  51.24 2.51 90 top
C10  100uF  [C1206]  86.51 13.62 90 top
C11  100uF  [C1206]  78.38 13.62 90 top
C12  100uF  [C1206]  67.37 4 90 top
C13  100uF  [C1206]  62.99 4 90 top
C14  100uF  [C1206]  82.32 13.62 90 top
C17  100nF  [R0603]  58.16 55.62 180 bottom
C18  100nF  [R0603]  58.17 53.72 180 bottom
C19  100nF  [R0603]  53.21 58.04 270 bottom
C20  100nF  [R0603]  46.59 43.36 90 bottom
C21  100nF  [R0603]  43.43 53.38 0 bottom
C22  100nF  [R0603]  57.9 43.17 180 bottom
C33  12pF  [R0603]  57.91 44.96 180 bottom
C34  12pF  [R0603]  58.16 52.09 180 bottom
C35  100uF  [C1206]  59.05 4 90 top
C36  100nF  [R0603]  69.72 6.35 270 top
C37  100nF  [R0603]  47.92 2.49 90 top
C38  22uF  [C0603]  12.97 23.13 180 top
C39  22uF  [C0603]  9.97 15.19 90 top
C40  22uF  [C0603]  25.65 21.84 0 top
C41  22uF  [C0603]  25.6 24.22 0 top
D1  SS54  [SMA_L4.3-W2.6-LS5.0-FD]  58.55 14.22 90 top
D2  SS34  [SMA_L4.3-W2.6-LS5.0-FD]  20.7 19.56 0 top
D3  1N4148W-E3-08  [SOD-123_L2.8-W1.8-LS3.7-RD]  26.54 19.57 180 top
H1  HX PZ2.54-4x2P ZZ  [HDR-TH_8P-P2.54-V-M-R2-C4-S2.54]  17.91 86.36 180 bottom
H2  2.54-1*4P母  [HDR-TH_4P-P2.54-V-F]  33.4 8.76 180 bottom
H3  PZ254V-12-10P  [HDR-TH_10P-P2.54-V-M-R2-C5-S2.54]  82 4 180 bottom
H5  PZ254V-12-10P  [HDR-TH_10P-P2.54-V-M-R2-C5-S2.54]  18 4 180 bottom
L1  22uH  [IND-SMD_L7.1-W6.6]  64.64 12.32 270 top
L2  3.3uH  [IND-SMD_L4.4-W4.2-A]  14.1 19.56 180 top
LED1  LTST-C190KSKT  [LED0603-RD]  38.67 5.23 270 bottom
LED4  -  [LED_0603]  70.65 5.12 270 bottom
LED5  -  [LED_0603]  28.97 5.25 90 bottom
LED7  -  [LED_0603]  31.62 5.25 90 bottom
LED8  LTST-C190KSKT  [LED0603-RD]  65.28 5.21 270 bottom
Q1  -  [S8550P_SOT]  24 13.59 90 top
R6  10K  [R0603]  73.91 6.35 270 top
R7  10K  [R0603]  77.98 8.77 90 top
R9  1K  [R0603]  73.28 5.08 90 bottom
R12  1kΩ  [R0603]  36.32 5.21 90 bottom
R14  10kΩ  [R0603]  57.4 58.04 90 bottom
R36  360  [R0603]  50.81 58.05 90 bottom
R37  1.5K  [R0603]  48.9 58.03 270 bottom
R38  1.5K  [R0603]  55.32 58.04 270 bottom
R39  5.1K  [R0603]  10.03 18.67 270 top
R40  5.1K  [R0603]  5.09 11.04 270 top
R41  190K  [R0603]  22.33 16.89 180 top
R42  10K  [R0603]  18.03 16.13 270 top
R43  500R  [R0603]  34.16 5.21 270 bottom
R44  1K  [R0603]  27.58 15.61 270 top
R45  1kΩ  [R0603]  67.69 5.21 90 bottom
SW1  TS-1101-B-W  [KEY-SMD_2P-L6.0-W3.6-P7.4-LS8.0-L]  73 86 270 bottom
SW2  SS-12D10L5  [SW-TH_SS-12D10L5]  93.21 16.51 90 top
SW3  TS-1101-B-W  [KEY-SMD_2P-L6.0-W3.6-P7.4-LS8.0-L]  58 86 90 bottom
SW4  TS-1101-B-W  [KEY-SMD_2P-L6.0-W3.6-P7.4-LS8.0-L]  68 86 90 bottom
SW5  TS-1101-B-W  [KEY-SMD_2P-L6.0-W3.6-P7.4-LS8.0-L]  63 86 270 bottom
SW6  TS-1101-B-W  [KEY-SMD_2P-L6.0-W3.6-P7.4-LS8.0-L]  27 86 90 bottom
SW7  TS-1101-B-W  [KEY-SMD_2P-L6.0-W3.6-P7.4-LS8.0-L]  32 86 90 bottom
SW8  TS-1101-B-W  [KEY-SMD_2P-L6.0-W3.6-P7.4-LS8.0-L]  37 86 90 bottom
SW9  TS-1101-B-W  [KEY-SMD_2P-L6.0-W3.6-P7.4-LS8.0-L]  42 86 90 bottom
U1  STM32F103C8T6  [LQFP-48_L7.0-W7.0-P0.50-LS9.0-BL]  50 50 270 bottom
U14  TPS5450DDAR  [SOP-8_L4.9-W3.9-P1.27-LS6.0-BL-EP]  74.04 12.32 0 top
U15  TLV75533PDBVR  [SOT-23-5_L3.0-W1.7-P0.95-LS2.8-BR]  54.48 4.7 0 top
U31  HFP6291LR-G1  [SOT-23-6_L2.9-W1.6-P0.95-LS2.8-BR]  13.46 14.99 0 top
U32  PM254-1-08-Z-8.5  [HDR-TH_8P-P2.54-V-F]  50 8.76 180 bottom
USB1  TYPEC-324G-BCP24  [USB-C-SMD_TYPEC-324G-BCP24]  5.72 17.27 270 top
X3  8MHz  [CRYSTAL-SMD_4P-L3.2-W2.5-BL-1]  58.04 48.52 270 bottom

## Footprints (pads in the part's own frame, mm; a bottom-side part is the same pattern mirrored in y, then rotated)
BAT-SMD_BH-18650-B5BA016
  rect 5.2x7.4 smd: 1(-41.15,18.5) 2(41.15,18.5) 3(-41.15,0) 4(41.15,0) 5(-41.15,-18.5) 6(41.15,-18.5)
C0603
  rect 0.8x0.9 smd: 1(-0.7,0) 2(0.7,0)
C1206
  rect 1.485x1.728 smd: 1(-1.593,0) 2(1.593,0)
CRYSTAL-SMD_4P-L3.2-W2.5-BL-1
  rect 1.4x1.2 smd: 1(-1.1,-0.875) 2(1.1,-0.875) 3(1.1,0.875) 4(-1.1,0.875)
HDR-TH_4P-P2.54-V-F
  rect 1.7x1.7 hole 1.1: 1(-3.81,0)
  round 1.7 hole 1.1: 2(-1.27,0) 3(1.27,0) 4(3.81,0)
HDR-TH_8P-P2.54-V-F
  rect 1.575x1.7 hole 1.1: 1(-8.89,0)
  round 1.7 hole 1.1: 2(-6.35,0) 3(-3.81,0) 4(-1.27,0) 5(1.27,0) 6(3.81,0) 7(6.35,0) 8(8.89,0)
HDR-TH_8P-P2.54-V-M-R2-C4-S2.54
  rect 1.7x1.7 hole 1.1: 1(-3.81,-1.27)
  round 1.7 hole 1.1: 2(-3.81,1.27) 3(-1.27,-1.27) 4(-1.27,1.27) 5(1.27,-1.27) 6(1.27,1.27) 7(3.81,-1.27) 8(3.81,1.27)
HDR-TH_10P-P2.54-V-M-R2-C5-S2.54
  rect 1.7x1.7 hole 1.1: 1(-5.08,-1.27)
  round 1.7 hole 1.1: 2(-5.08,1.27) 3(-2.54,-1.27) 4(-2.54,1.27) 5(0,-1.27) 6(0,1.27) 7(2.54,-1.27) 8(2.54,1.27) 9(5.08,-1.27) 10(5.08,1.27)
IND-SMD_L4.4-W4.2-A
  rect 1.4x2.4 smd: 1(2.028,0) 2(-2.028,0)
IND-SMD_L7.1-W6.6
  rect 2.15x3.32 smd: 1(-2.913,0) 2(2.913,0)
KEY-SMD_2P-L6.0-W3.6-P7.4-LS8.0-L
  rect 1.2x1 smd: 1(-3.7,0) 2(3.7,0)
LED0603-RD
  rect 0.8x0.8 smd: 1(-0.799,0) 2(0.799,0)
LED_0603
  rect 0.8x0.8 smd: 1(-0.851,-0.01) 2(0.75,-0.005)
LQFP-48_L7.0-W7.0-P0.50-LS9.0-BL
  oval 0.27x1.5 smd: 1(-2.75,-4.25) 2(-2.25,-4.25) 3(-1.75,-4.25) 4(-1.25,-4.25) 5(-0.75,-4.25) 6(-0.25,-4.25) 7(0.25,-4.25) 8(0.75,-4.25) 9(1.25,-4.25) 10(1.75,-4.25) 11(2.25,-4.25) 12(2.75,-4.25) 25(2.75,4.25) 26(2.25,4.25) 27(1.75,4.25) 28(1.25,4.25) 29(0.75,4.25) 30(0.25,4.25) 31(-0.25,4.25) 32(-0.75,4.25) 33(-1.25,4.25) 34(-1.75,4.25) 35(-2.25,4.25) 36(-2.75,4.25)
  oval 1.5x0.27 smd: 13(4.25,-2.75) 14(4.25,-2.25) 15(4.25,-1.75) 16(4.25,-1.25) 17(4.25,-0.75) 18(4.25,-0.25) 19(4.25,0.25) 20(4.25,0.75) 21(4.25,1.25) 22(4.25,1.75) 23(4.25,2.25) 24(4.25,2.75) 37(-4.25,2.75) 38(-4.25,2.25) 39(-4.25,1.75) 40(-4.25,1.25) 41(-4.25,0.75) 42(-4.25,0.25) 43(-4.25,-0.25) 44(-4.25,-0.75) 45(-4.25,-1.25) 46(-4.25,-1.75) 47(-4.25,-2.25) 48(-4.25,-2.75)
R0603
  rect 0.806x0.864 smd: 1(-0.753,0) 2(0.753,0)
S8550P_SOT
  rect 1.25x0.701 smd: 1(1.292,-0.95) 2(1.292,0.95) 3(-1.208,0)
SMA_L4.3-W2.6-LS5.0-FD
  rect 2.046x1.62 smd: 1(-2.304,-0.009) 2(2.304,0.009)
SOD-123_L2.8-W1.8-LS3.7-RD
  rect 0.95x1.15 smd: 1(-1.692,0) 2(1.692,0)
SOP-8_L4.9-W3.9-P1.27-LS6.0-BL-EP
  oval 0.6x1.8 smd: 1(-1.905,-2.772) 2(-0.635,-2.772) 3(0.635,-2.772) 4(1.905,-2.772) 5(1.905,2.772) 6(0.635,2.772) 7(-0.635,2.772) 8(-1.905,2.772)
  rect 2.29x2.29 smd: 9(0,0)
SOT-23-5_L3.0-W1.7-P0.95-LS2.8-BR
  rect 1.1x0.6 smd: 1(1.3,-0.95) 2(1.3,0) 3(1.3,0.95) 4(-1.3,0.95) 5(-1.3,-0.95)
SOT-23-6_L2.9-W1.6-P0.95-LS2.8-BR
  rect 1.1x0.6 smd: 1(1.35,-0.95) 2(1.35,0) 3(1.35,0.95) 4(-1.35,0.95) 5(-1.35,0) 6(-1.35,-0.95)
SW-TH_SS-12D10L5
  oval 2x3 hole 1.3x2: 1(-4.7,0) 2(0,0) 3(4.7,0)
USB-C-SMD_TYPEC-324G-BCP24
  oval 1.6x2.2 hole 1.2x1.6: 1(-4.12,1.938) 2(4.12,1.938)
  oval 1.2x2.5 hole 0.6x1.9: 3(-4.32,-2.612) 4(4.32,-2.612)
  rect 0.3x0.95 smd: A1(-2.63,2.612) A2(-2.13,2.612) A3(-1.63,2.612) A4(-1.13,2.612) A5(-0.63,2.612) A6(-0.13,2.612) A7(0.37,2.612) A8(0.87,2.612) A9(1.37,2.612) A10(1.87,2.612) A11(2.37,2.612) A12(2.87,2.612) B1(2.62,1.262) B2(2.12,1.262) B3(1.62,1.262) B4(1.12,1.262) B5(0.62,1.262) B6(0.12,1.262) B7(-0.38,1.262) B8(-0.88,1.262) B9(-1.38,1.262) B10(-1.88,1.262) B11(-2.38,1.262) B12(-2.88,1.262)

## Nets
As in the schematic.

Pads without a net: SW2 1; U14 2 3 5; U15 4; U31 6; U32 5; USB1 1 2 3 4 A2 A3 A4 A6 A7 A8 A10 A11 B2 B3 B6 B7 B8 B9 B10 B11

## Via types
v1: diameter 0.61, hole 0.305, Top Layer to Bottom Layer, 80 vias

## Routing (per net, layer and track width the routed paths; a pad name or vN(x,y) marks a point on that pad's centre or on a via; arc(x,y) is an arc through that point)
3V3: length 275
  Top Layer w0.254: v1(46.59,44.15) 47.58,43.17 v1(57.15,43.17) 54.23,46.09 54.23,51.56 v1(55.42,52.75) ; v1(55.42,52.75) 56.39,53.72 v1(57.41,53.72) ; v1(55.42,52.75) 53.21,54.95 v1(53.21,57.29)
  Bottom Layer w0.254: H5.8 15.46,74.64 20.31,79.49 20.31,86.22 H1.2 ; R14.2 56.65,58.04 53.97,58.04 v1(53.21,57.29) 53.21,55.89 52.75,55.43 U1.48 ; U1.24 47.25,44.77 C20.2 ; U1.36 44.81,52.75 C21.2 ; v1(57.41,53.72) 56.39,53.72 v1(55.42,52.75) U1.1
  Bottom Layer w0.33: 44.18,89.7 SW3.2 59.69,88.01 66.17,88.01 67.85,89.7 SW4.2 ; 44.18,89.7 C21.2 ; 44.18,89.7 SW9.2 SW8.2 SW7.2 SW6.2 23.79,89.7 H1.2 ; v1(50.62,4.84) 58.32,4.84 63.12,9.64 63.12,35.18 57.15,41.15 v1(57.15,43.17) 55.57,44.75 55.57,48.19 55.01,48.75 U1.9
  Bottom Layer w1: v1(50.62,4.84) v1(49.62,4.84) v1(48.62,4.84)
  vias: v1(36.32,6) v1(43.62,5.84) v1(43.62,4.84) v1(44.62,5.84) v1(44.62,4.84) v1(45.62,5.84) v1(45.62,4.84) v1(46.62,5.84) v1(46.62,4.84) v1(47.62,5.84) v1(47.62,4.84) v1(48.62,5.84) v1(49.62,5.84) v1(50.62,5.84)
+5V: length 107.1
  Top Layer w1: 56.39,5.97 56.39,8.73 U32.2 53.56,11.56 40,11.56 H2.1 37.08,8.76 v1(33.59,12.26)
  Bottom Layer w1: v1(33.59,12.26) v1(33.08,12.77) v1(32.51,13.34) 32.51,50.29 26.32,56.48 26.32,80.49 H1.1
  vias: v1(67.69,6)
+12V: length 16.5
  Bottom Layer w1: v1(25.27,17.64) v1(25.27,16.64) 25.15,16.51 25.15,8.76 27.91,6 LED5.2 LED7.2
  vias: v1(23.24,19.43) v1(23.27,18.64) v1(23.27,17.64) v1(23.27,16.64) v1(24.26,19.44) v1(24.27,18.64) v1(24.27,17.64) v1(24.27,16.64) v1(25.27,19.46) v1(25.27,18.64)
GND: length 11.9
  Top Layer w0.5: U15.2 54.99,4.7 54.48,4.19 54.48,1.4
  Bottom Layer w0.254: U1.35 v1(43.56,52.25) ; U1.23 47.75,43.56 47.62,43.44 ; v1(55.38,49.26) 54.26,49.26 U1.8
  Bottom Layer w0.33: v1(52.23,56.16) 52.25,56.14 U1.47
  vias: v1(42.67,53.38) v1(46.59,42.61) v1(48.9,58.78) v1(53.2,58.83) v1(56.85,50.04) v1(56.85,49.24) v1(57.37,52.09) v1(57.53,50.04) v1(57.5,49.24) v1(58.57,47.88) v1(58.57,46.99) v1(58.67,44.96) v1(58.7,43.17) v1(58.92,53.72) v1(59.31,47.88) v1(59.31,46.99) v1(63,89.7) v1(73,89.7) v1(74.67,15.34) v1(74.67,14.59)
VCC: length 3.1
  Top Layer w0.29: USB1.A9 7.78,15.9 7.53,16.15 USB1.B4
  Top Layer w0.35: C39.2 9.96,15.9 USB1.A9
BOOT0: length 5
  Bottom Layer w0.254: U1.44 50.75,57.24 R36.1 48.92,57.3 R37.2
BOOT1: length 14.1
  Bottom Layer w0.254: U1.20 49.34,45.84 49.34,46.54 49.38,46.58 49.38,49.58 55.32,55.52 R38.2
NRST: length 42.4
  Bottom Layer w0.254: SW1.2 73,72.88 R14.1 C17.2 55.92,55.62 53.22,52.92 53.22,50.08 53.46,49.84 54.16,49.84 U1.7
OSC_IN: length 7.6
  Bottom Layer w0.254: U1.5 57.78,50.75 58.91,49.62 58.91,52.09
OSC_OUT: length 7.6
  Bottom Layer w0.254: U1.6 55.41,50.25 56.01,49.66 56.01,47.88 56.47,47.42 X3.3 57.16,44.96 C33.2
PA13/SWDIO: length 55.6
  Top Layer w0.254: H1.4 20.83,89.28 24.51,89.28 46.66,67.13 46.66,52.63 45.66,51.63 v1(44.58,51.63)
  Bottom Layer w0.254: U1.34 44.7,51.75 v1(44.58,51.63)
PA14/SWCLK: length 53.9
  Top Layer w0.254: H1.6 18.8,89.79 24.77,89.79 47.24,67.31 v1(47.24,55.63)
  Bottom Layer w0.254: U1.37 47.25,55.62 v1(47.24,55.63)
PB0_DC: length 38.7
  Bottom Layer w0.254: U1.18 50.25,12.82 U32.6
PB1_BL: length 40.6
  Bottom Layer w0.254: U32.8 49.75,17.4 U1.19
PB12_01: length 48
  Bottom Layer w0.254: SW6.1 27.05,82.25 27.05,57.02 36.82,47.25 U1.25
PB13_02: length 49
  Bottom Layer w0.254: SW7.1 27.56,77.86 27.56,57.28 37.09,47.75 U1.26
PB14_03: length 50
  Bottom Layer w0.254: U1.27 37.35,48.25 28.07,57.53 28.07,73.37 SW8.1
PB15_04: length 50.9
  Bottom Layer w0.254: SW9.1 28.57,68.88 28.57,57.91 37.74,48.75 U1.28
SPI_CS_NSS: length 60.3
  Bottom Layer w0.254: U1.14 52.25,24.46 62.36,14.35 62.36,9.91 59.94,7.49 44.92,7.49 U32.7
SPI_SCL_SCK: length 37.8
  Bottom Layer w0.254: U32.3 53.81,10.07 51.75,12.13 U1.15
SPI_SDA_MOSI: length 37.2
  Bottom Layer w0.254: U1.17 50.75,9.28 U32.4
USART1_RX: length 55.2
  Top Layer w0.254: v1(44.58,50.42) 43.33,51.67 43.32,51.67 26.67,68.31 26.67,82.23 22.68,86.22 16.17,86.22 15.04,85.09 H1.7
  Bottom Layer w0.254: U1.31 44.75,50.25 v1(44.58,50.42)
USART1_TX: length 48.4
  Top Layer w0.254: v1(44.58,49.53) 16.64,77.47 H1.5
  Bottom Layer w0.254: U1.30 44.8,49.75 v1(44.58,49.53)
USART3_RX: length 43.7
  Bottom Layer w0.254: U1.22 48.25,24.88 H2.3
USART3_TX: length 43.1
  Bottom Layer w0.254: H2.2 35.12,8.76 48.75,22.4 U1.21
$1N1992: length 2.4
  Bottom Layer w0.5: LED1.2 38.65,4.45 R12.1
$1N3257: length 31.7
  Bottom Layer w0.254: SW4.1 SW5.2 63,66.47 R38.1
$1N4251: length 13.8
  Bottom Layer w1: v1(76.28,18.42) v1(76.28,17.42) v1(76.28,16.42) 76.28,8.83 R9.2
  vias: v1(73.28,18.42) v1(73.28,17.42) v1(73.28,16.42) v1(74.28,18.42) v1(74.28,17.42) v1(74.28,16.42) v1(75.28,18.42) v1(75.28,17.42) v1(75.28,16.42)
$1N4256: length 5.2
  Top Layer w1: 72.13,9.55 71.36,9.55 70.36,10.55 70.36,13.52 C7.1
$1N4260: length 5.9
  Top Layer w1: 77.99,9.53 77.98,9.55 75.94,9.55 75.94,8.12 74.93,7.1 R6.1
$1N4269: length 2.6
  Bottom Layer w1: R9.1 70.7,4.33 LED4.2
$1N14427: length 1.7
  Top Layer w0.35: 10.03,17.89 10.02,17.9 USB1.A5
$1N14460: length 6.1
  Top Layer w0.35: R40.1 5.09,15.64 6.11,16.65 USB1.B5
$1N14741: length 8.3
  Top Layer w0.8: U31.1 14.03,14.04 13.36,14.7 13.36,17.84 15.08,19.56 L2.2
$1N14892: length 7.3
  Top Layer w0.254: 21.58,16.89 21.58,16.76 21.57,16.76
  Top Layer w0.8: U31.3 16.85,15.94 16.85,15.96 17.65,16.76 21.57,16.76
$1N19318: length 16.3
  Bottom Layer w1: 34.11,4.4 LED7.1 LED5.1 27.86,4.4 24,8.26 v1(24,11.54) v1(24,12.17) v1(24,12.86)
$1N19371: length 2.6
  Top Layer w0.8: Q1.1 27.56,14.88 R44.2
$1N21612: length 26.5
  Bottom Layer w0.254: R36.2 50.81,75.11 SW3.1
$1N31426: length 2.4
  Bottom Layer w1: LED8.2 65.32,4.45 R45.1

## Copper pours and planes (outline as drawn; the poured copper is in the pictures)
3V3 on Top Layer: 11.65,6.54 52.21,6.54 52.21,4 11.65,4
3V3 on Top Layer: 24.51,6.35 53.85,6.35 53.85,2.41 24.51,2.41
3V3 on Bottom Layer: 43.43,90.3 44.96,90.3 44.96,88.77 43.43,88.77
3V3 on Bottom Layer: 42.93,6.48 52.07,6.48 52.07,4.06 42.93,4.06
+5V on Top Layer: 65.78,6.46 88.52,6.46 88.52,3.81 65.78,3.81
+5V on Top Layer: 55.07,6.86 61.53,6.86 61.53,3.15 55.07,3.15
+5V on Top Layer: 60.45,10.54 68.83,10.54 68.83,4.57 60.45,4.57
+5V on Top Layer: 57.4,6.86 68.83,6.86 68.83,3.43 57.4,3.43
+12V on Top Layer: 22.33,19.57 25.61,19.57 25.61,16.14 22.33,16.14
+12V on Top Layer: 22.21,16.89 24.34,16.89 24.34,13.94 22.21,13.94
+12V on Top Layer: 21.84,25.02 25.65,25.02 25.65,18 21.84,18
+12V on Bottom Layer: 22.33,19.94 25.78,19.94 25.78,16 22.33,16
GND on Top Layer: 0,92 100.08,92 100.08,-0.13 0,-0.13
GND on Bottom Layer: 0,92 100.08,92 100.08,-0.13 0,-0.13
VCC on Top Layer: 11.18,24.64 12.85,24.64 12.85,14.43 11.18,14.43
VCC on Top Layer: 9.36,16.49 12.8,16.49 12.8,15.18 9.36,15.18
VIN on Top Layer: 25.91,20.44 57.28,20.44 57.28,15.75 25.91,15.75
VIN on Top Layer: 87,39.62 97.46,39.62 97.46,19.14 87,19.14
VIN on Top Layer: 29.72,26.92 97.28,26.92 97.28,19.05 29.72,19.05
$1N4251 on Top Layer: 72.75,18.92 95.12,18.92 95.12,13.87 72.75,13.87
$1N4251 on Bottom Layer: 72.77,18.8 76.84,18.8 76.84,16 72.77,16
$1N4254 on Top Layer: 56.13,18.92 72.77,18.92 72.77,14.1 56.13,14.1
$1N6190 on Top Layer: 4.95,58.29 12.83,58.29 12.83,30.86 4.95,30.86
$1N6207 on Top Layer: 86.61,77.34 95.88,77.34 95.88,48.64 86.61,48.64
$1N14741 on Top Layer: 14.99,20.83 19.77,20.83 19.77,18.29 14.99,18.29
$1N19318 on Top Layer: 23.37,13.46 24.64,13.46 24.64,11.05 23.37,11.05

Small or netless copper shapes (teardrops, artwork), in the pictures only: 1 on Top Layer
